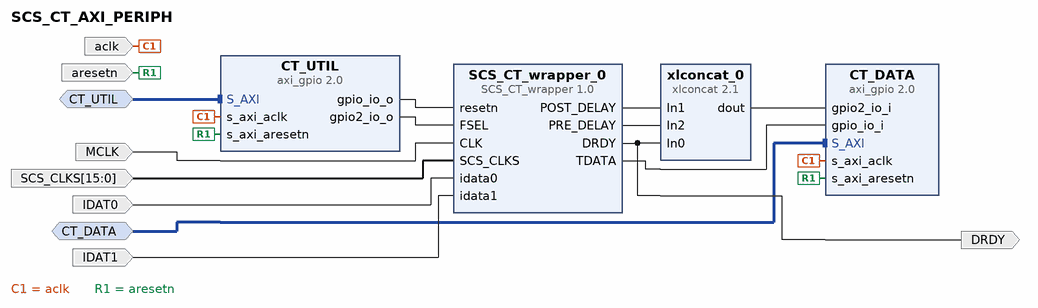
[diagram p0: block diagram of the top level]
# Vivado block design SCS_CT_AXI_PERIPH, xc7z020clg400-1, Vivado 2019.1
create_bd_design SCS_CT_AXI_PERIPH

create_bd_intf_port -mode Slave -vlnv xilinx.com:interface:aximm_tlm:1.0 CT_DATA
create_bd_intf_port -mode Slave -vlnv xilinx.com:interface:aximm_tlm:1.0 CT_UTIL
create_bd_port -dir O -type data DRDY
create_bd_port -dir I -type clk MCLK
set_property -dict {CONFIG.FREQ_HZ 460000000} [get_bd_ports MCLK]
create_bd_port -dir I -from 15 -to 0 -type clk SCS_CLKS
set_property -dict {CONFIG.FREQ_HZ 460000000} [get_bd_ports SCS_CLKS]
create_bd_port -dir I -type data IDAT0
create_bd_port -dir I -type data IDAT1
create_bd_port -dir I -type clk aclk
set_property -dict {CONFIG.FREQ_HZ 100000000} [get_bd_ports aclk]
create_bd_port -dir I -type rst aresetn

create_bd_cell -type ip -vlnv xilinx.com:ip:axi_gpio:2.0 CT_DATA
set_property -dict [list \
  CONFIG.C_ALL_INPUTS 1 \
  CONFIG.C_ALL_INPUTS_2 1 \
  CONFIG.C_GPIO2_WIDTH 17 \
  CONFIG.C_IS_DUAL 1 \
] [get_bd_cells CT_DATA]
create_bd_cell -type ip -vlnv xilinx.com:ip:xlconcat:2.1 xlconcat_0
set_property -dict {CONFIG.IN0_WIDTH 1 CONFIG.IN1_WIDTH 8 CONFIG.IN2_WIDTH 8 CONFIG.NUM_PORTS 3} [get_bd_cells xlconcat_0]
create_bd_cell -type ip -vlnv xilinx.com:ip:axi_gpio:2.0 CT_UTIL
set_property -dict [list \
  CONFIG.C_ALL_OUTPUTS 1 \
  CONFIG.C_ALL_OUTPUTS_2 1 \
  CONFIG.C_GPIO2_WIDTH 1 \
  CONFIG.C_GPIO_WIDTH 1 \
  CONFIG.C_IS_DUAL 1 \
] [get_bd_cells CT_UTIL]
create_bd_cell -type ip -vlnv cri.nz:user:SCS_CT_wrapper:1.0 SCS_CT_wrapper_0

# ---- connections ----

connect_bd_intf_net [get_bd_intf_ports CT_DATA] [get_bd_intf_pins CT_DATA/S_AXI]
connect_bd_intf_net [get_bd_intf_ports CT_UTIL] [get_bd_intf_pins CT_UTIL/S_AXI]
connect_bd_net [get_bd_pins SCS_CT_wrapper_0/DRDY] [get_bd_pins xlconcat_0/In0] [get_bd_ports DRDY]
connect_bd_net [get_bd_pins SCS_CT_wrapper_0/POST_DELAY] [get_bd_pins xlconcat_0/In1]
connect_bd_net [get_bd_pins SCS_CT_wrapper_0/PRE_DELAY] [get_bd_pins xlconcat_0/In2]
connect_bd_net [get_bd_pins SCS_CT_wrapper_0/TDATA] [get_bd_pins CT_DATA/gpio_io_i]
connect_bd_net [get_bd_pins xlconcat_0/dout] [get_bd_pins CT_DATA/gpio2_io_i]
connect_bd_net [get_bd_pins CT_UTIL/gpio_io_o] [get_bd_pins SCS_CT_wrapper_0/resetn]
connect_bd_net [get_bd_pins CT_UTIL/gpio2_io_o] [get_bd_pins SCS_CT_wrapper_0/FSEL]
connect_bd_net [get_bd_ports MCLK] [get_bd_pins SCS_CT_wrapper_0/CLK]
connect_bd_net [get_bd_ports SCS_CLKS] [get_bd_pins SCS_CT_wrapper_0/SCS_CLKS]
connect_bd_net -net IDAT0_1 [get_bd_ports IDAT0] [get_bd_pins SCS_CT_wrapper_0/idata0]
connect_bd_net -net IDAT1_1 [get_bd_ports IDAT1] [get_bd_pins SCS_CT_wrapper_0/idata1]
connect_bd_net [get_bd_ports aclk] [get_bd_pins CT_UTIL/s_axi_aclk] [get_bd_pins CT_DATA/s_axi_aclk]
connect_bd_net [get_bd_ports aresetn] [get_bd_pins CT_UTIL/s_axi_aresetn] [get_bd_pins CT_DATA/s_axi_aresetn]

validate_bd_design
save_bd_design
